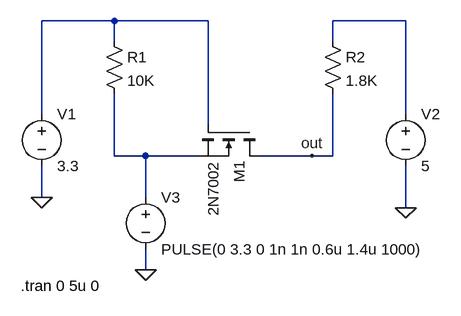
[diagram p0: schematic simulation.asc]
simulation.asc, the LTspice schematic file:
Version 4
SHEET 1 880 680
WIRE 80 32 -32 32
WIRE 224 32 80 32
WIRE 528 32 416 32
WIRE 80 64 80 32
WIRE 416 64 416 32
WIRE -32 176 -32 32
WIRE 528 176 528 32
WIRE 224 192 224 32
WIRE 80 240 80 144
WIRE 128 240 80 240
WIRE 208 240 128 240
WIRE 384 240 304 240
WIRE 416 240 416 144
WIRE 416 240 384 240
WIRE -32 304 -32 256
WIRE 128 304 128 240
WIRE 528 320 528 256
WIRE 128 416 128 384
FLAG -32 304 0
FLAG 528 320 0
FLAG 128 416 0
FLAG 384 240 out
SYMBOL res 64 48 R0
SYMATTR InstName R1
SYMATTR Value 10K
SYMBOL res 400 48 R0
SYMATTR InstName R2
SYMATTR Value 1.8K
SYMBOL voltage -32 160 R0
WINDOW 123 0 0 Left 0
WINDOW 39 0 0 Left 0
SYMATTR InstName V1
SYMATTR Value 3.3
SYMBOL voltage 528 160 R0
WINDOW 123 0 0 Left 0
WINDOW 39 0 0 Left 0
SYMATTR InstName V2
SYMATTR Value 5
SYMBOL nmos 304 192 R90
SYMATTR InstName M1
SYMATTR Value 2N7002
SYMBOL voltage 128 288 R0
WINDOW 123 0 0 Left 0
WINDOW 39 0 0 Left 0
SYMATTR InstName V3
SYMATTR Value PULSE(0 3.3 0 1n 1n 0.6u 1.4u 1000)
TEXT -64 440 Left 2 !.tran 0 5u 0

The netlist it stands for:
* simulation.asc
R1 N001 N003 10K
R2 N002 out 1.8K
V1 N001 0 3.3
V2 N002 0 5
M1 out N001 N003 N003 2N7002
V3 N003 0 PULSE(0 3.3 0 1n 1n 0.6u 1.4u 1000)
.model NMOS NMOS
.model PMOS PMOS
.lib standard.mos
.tran 0 5u 0
.backanno
.end